# Altium schematic sheet 03B_DDR3_2.SchDoc
size 420 x 297 mm
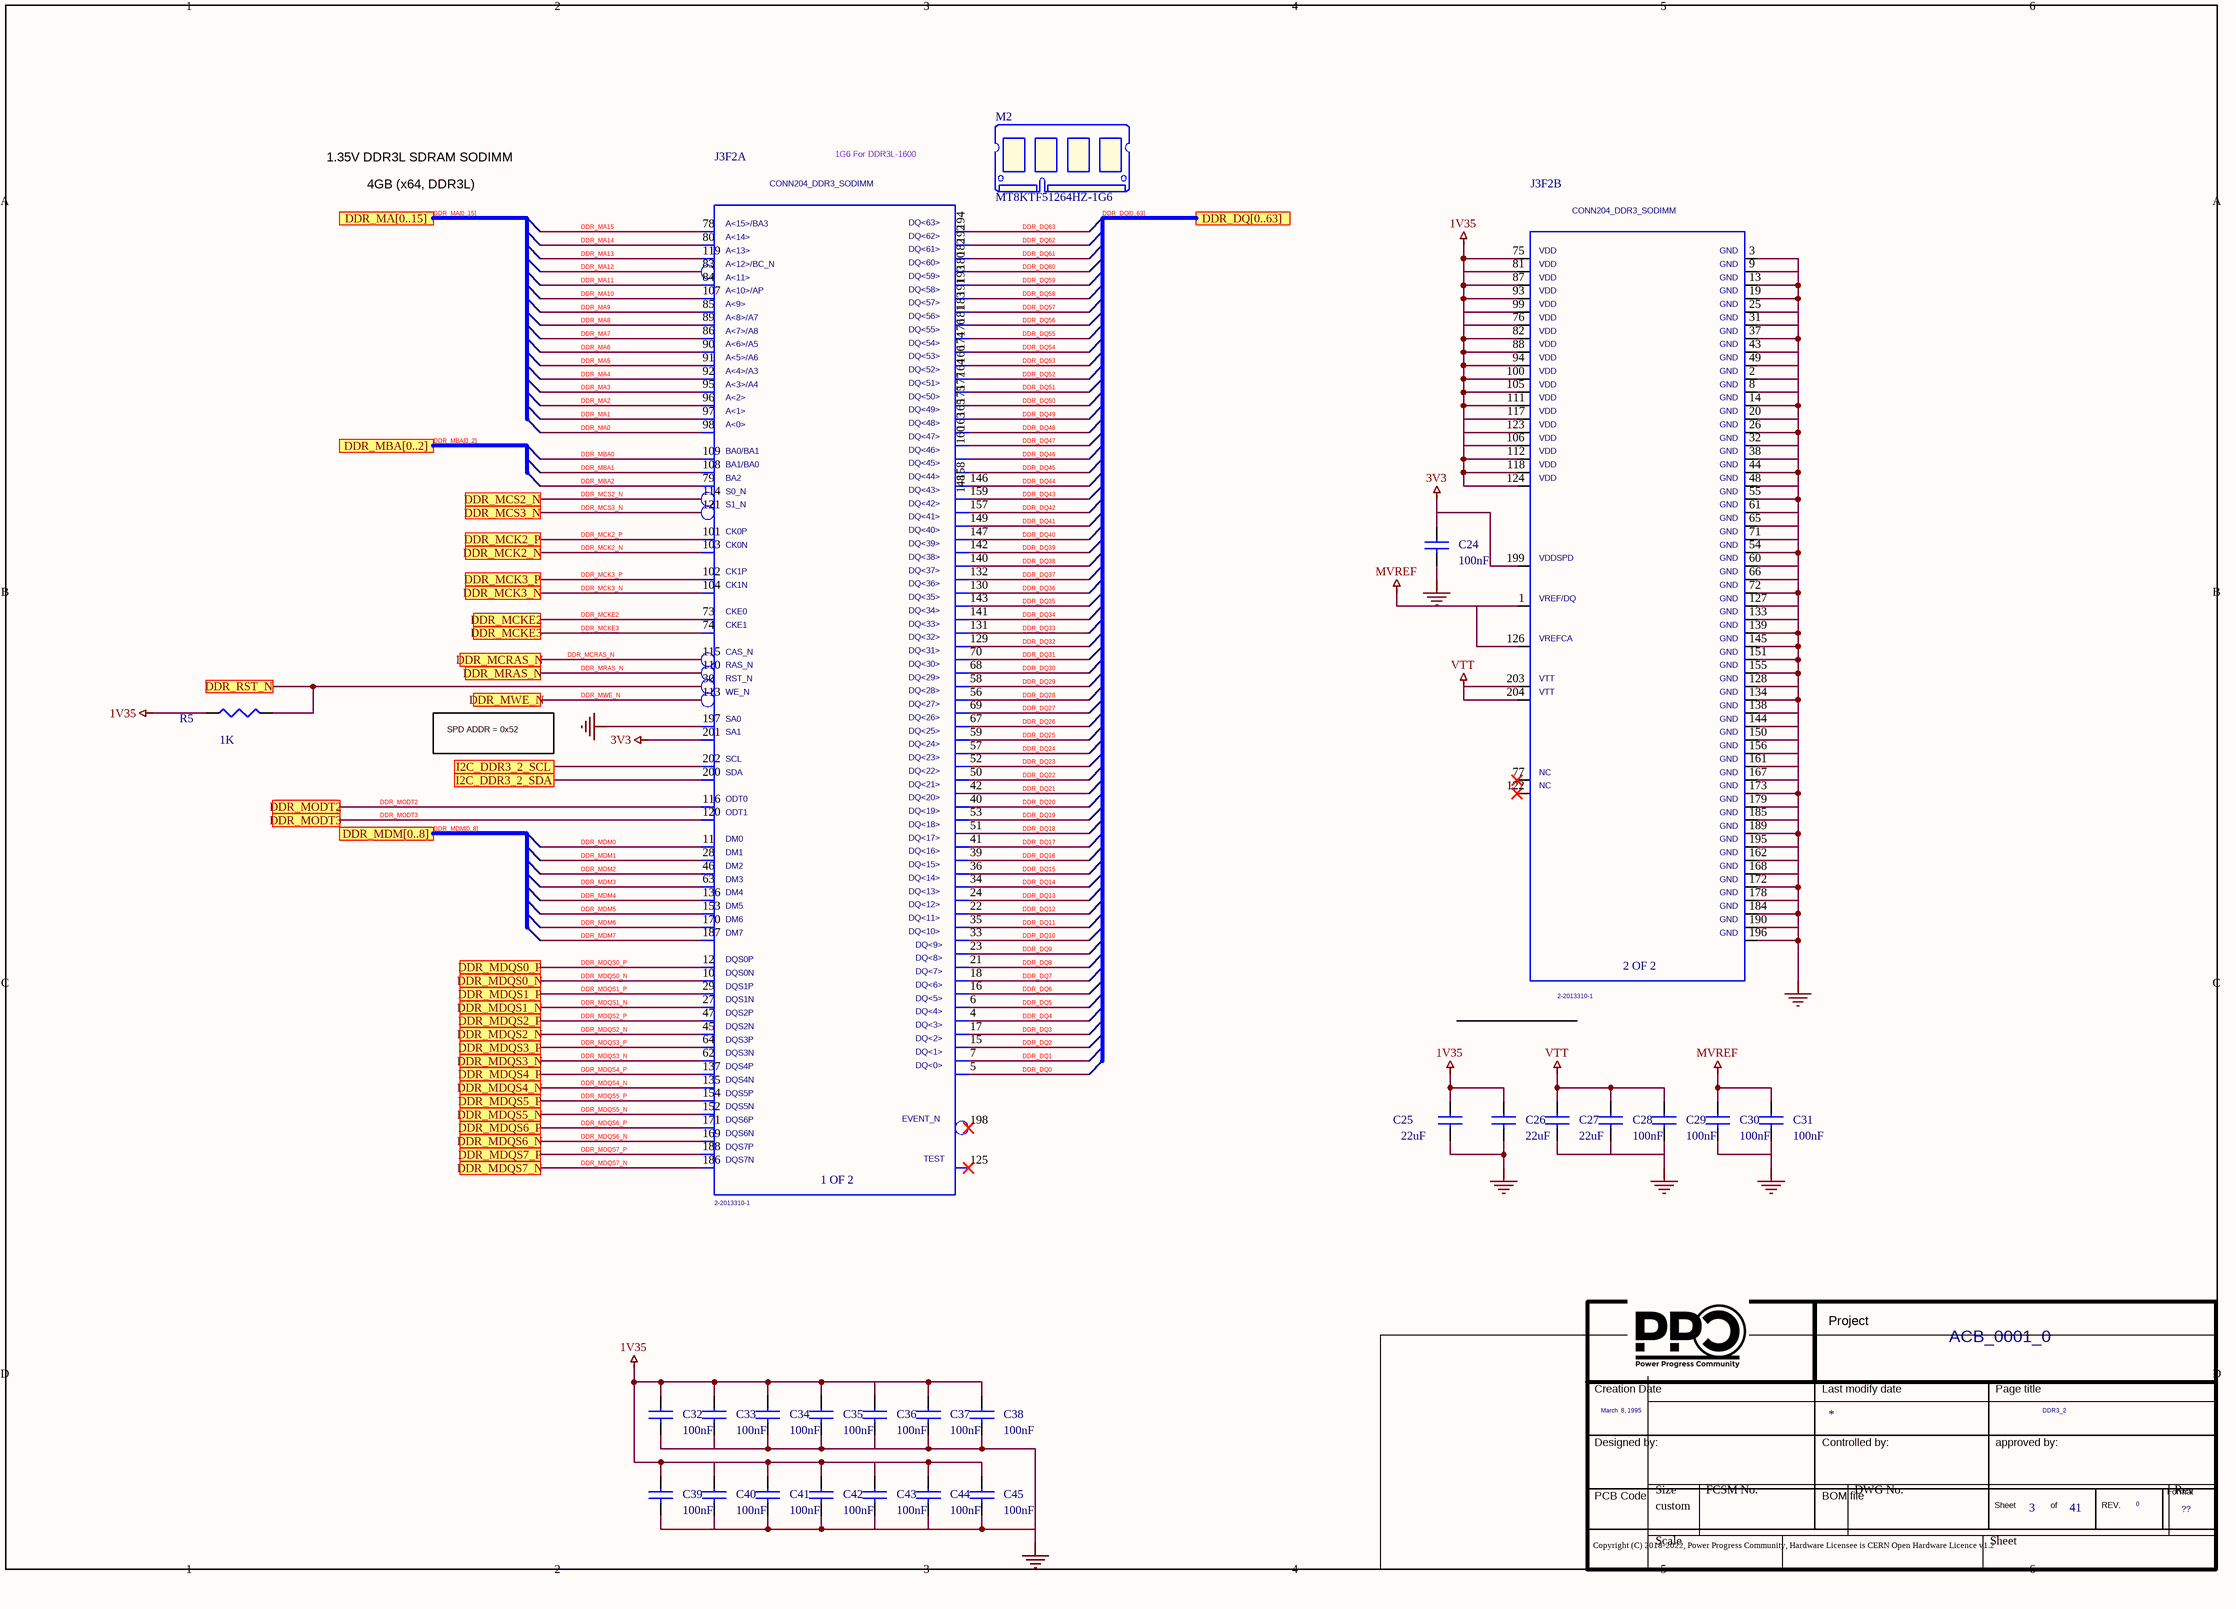
[diagram p0: 03B_DDR3_2.SchDoc]

## Parts
*  Page Count: 41  Page Create Date: March  8, 1995  Page Number: 3  Page Size: ??  Page Title: DDR3_2  RevCode: 0  Title: ACB_0001_0  (hidden comment: Title_block_PPC)  (graphical)
C24  100nF  [SMD_0402]
C25  22uF  [SMD_0805]
C26  22uF  [SMD_0805]
C27  22uF  [SMD_0805]
C28  100nF  [SMD_0402]
C29  100nF  [SMD_0402]
C30  100nF  [SMD_0402]
C31  100nF  [SMD_0402]
C32  100nF  [SMD_0402]
C33  100nF  [SMD_0402]
C34  100nF  [SMD_0402]
C35  100nF  [SMD_0402]
C36  100nF  [SMD_0402]
C37  100nF  [SMD_0402]
C38  100nF  [SMD_0402]
C39  100nF  [SMD_0402]
C40  100nF  [SMD_0402]
C41  100nF  [SMD_0402]
C42  100nF  [SMD_0402]
C43  100nF  [SMD_0402]
C44  100nF  [SMD_0402]
C45  100nF  [SMD_0402]
J3F2  2-2013310-1  PART_SYM_NUM: 1 OF 2  [204 PIN PASSO 0.6mm]  (parts A,B of 2)
M2  MT8KTF51264HZ-1G6  [none]
R5  1K  [SMD_0402]

## Ports
DDR_DQ[0..63], DDR_MA[0..15], DDR_MBA[0..2], DDR_MCK2_N, DDR_MCK2_P, DDR_MCK3_N, DDR_MCK3_P, DDR_MCKE2, DDR_MCKE3, DDR_MCRAS_N, DDR_MCS2_N, DDR_MCS3_N, DDR_MDM[0..8], DDR_MDQS0_N, DDR_MDQS0_P, DDR_MDQS1_N, DDR_MDQS1_P, DDR_MDQS2_N, DDR_MDQS2_P, DDR_MDQS3_N, DDR_MDQS3_P, DDR_MDQS4_N, DDR_MDQS4_P, DDR_MDQS5_N, DDR_MDQS5_P, DDR_MDQS6_N, DDR_MDQS6_P, DDR_MDQS7_N, DDR_MDQS7_P, DDR_MODT2, DDR_MODT3, DDR_MRAS_N, DDR_MWE_N, DDR_RST_N, I2C_DDR3_2_SCL, I2C_DDR3_2_SDA

## Nets
1V35: C25.1 C26.1 C32.1 C33.1 C34.1 C35.1 C36.1 C37.1 C38.1 C39.1 C40.1 C41.1 C42.1 C43.1 C44.1 C45.1 J3F2.75(VDD_75) J3F2.76(VDD_76) J3F2.81(VDD_81) J3F2.82(VDD_82) J3F2.87(VDD_87) J3F2.88(VDD_88) J3F2.93(VDD_93) J3F2.94(VDD_94) J3F2.99(VDD_99) J3F2.100(VDD_100) J3F2.105(VDD_105) J3F2.106(VDD_106) J3F2.111(VDD_111) J3F2.112(VDD_112) J3F2.117(VDD_117) J3F2.118(VDD_118) J3F2.123(VDD_123) J3F2.124(VDD_124) R5.1
3V3: C24.1 J3F2.199(VDDSPD) J3F2.201(SA1)
GND: C24.2 C25.2 C26.2 C27.2 C28.2 C29.2 C30.2 C31.2 C32.2 C33.2 C34.2 C35.2 C36.2 C37.2 C38.2 C39.2 C40.2 C41.2 C42.2 C43.2 C44.2 C45.2 J3F2.2(GND_2) J3F2.3(GND_3) J3F2.8(GND_8) J3F2.9(GND_9) J3F2.13(GND_13) J3F2.14(GND_14) J3F2.19(GND_19) J3F2.20(GND_20) J3F2.25(GND_25) J3F2.26(GND_26) J3F2.31(GND_31) J3F2.32(GND_32) J3F2.37(GND_37) J3F2.38(GND_38) J3F2.43(GND_43) J3F2.44(GND_44) J3F2.48(GND_48) J3F2.49(GND_49) J3F2.54(GND_54) J3F2.55(GND_55) J3F2.60(GND_60) J3F2.61(GND_61) J3F2.65(GND_65) J3F2.66(GND_66) J3F2.71(GND_71) J3F2.72(GND_72) J3F2.127(GND_127) J3F2.128(GND_128) J3F2.133(GND_133) J3F2.134(GND_134) J3F2.138(GND_138) J3F2.139(GND_139) J3F2.144(GND_144) J3F2.145(GND_145) J3F2.150(GND_150) J3F2.151(GND_151) J3F2.155(GND_155) J3F2.156(GND_156) J3F2.161(GND_161) J3F2.162(GND_162) J3F2.167(GND_167) J3F2.168(GND_168) J3F2.172(GND_172) J3F2.173(GND_173) J3F2.178(GND_178) J3F2.179(GND_179) J3F2.184(GND_184) J3F2.185(GND_185) J3F2.189(GND_189) J3F2.190(GND_190) J3F2.195(GND_195) J3F2.196(GND_196) J3F2.197(SA0)
MVREF: C30.1 C31.1 J3F2.1(VREF_DQ) J3F2.126(VREFCA)
VTT: C27.1 C28.1 C29.1 J3F2.203(VTT_203) J3F2.204(VTT_204)
DDR_DQ0: J3F2.5(DQ[0])
DDR_DQ1: J3F2.7(DQ[1])
DDR_DQ2: J3F2.15(DQ[2])
DDR_DQ3: J3F2.17(DQ[3])
DDR_DQ4: J3F2.4(DQ[4])
DDR_DQ5: J3F2.6(DQ[5])
DDR_DQ6: J3F2.16(DQ[6])
DDR_DQ7: J3F2.18(DQ[7])
DDR_DQ8: J3F2.21(DQ[8])
DDR_DQ9: J3F2.23(DQ[9])
DDR_DQ10: J3F2.33(DQ[10])
DDR_DQ11: J3F2.35(DQ[11])
DDR_DQ12: J3F2.22(DQ[12])
DDR_DQ13: J3F2.24(DQ[13])
DDR_DQ14: J3F2.34(DQ[14])
DDR_DQ15: J3F2.36(DQ[15])
DDR_DQ16: J3F2.39(DQ[16])
DDR_DQ17: J3F2.41(DQ[17])
DDR_DQ18: J3F2.51(DQ[18])
DDR_DQ19: J3F2.53(DQ[19])
DDR_DQ20: J3F2.40(DQ[20])
DDR_DQ21: J3F2.42(DQ[21])
DDR_DQ22: J3F2.50(DQ[22])
DDR_DQ23: J3F2.52(DQ[23])
DDR_DQ24: J3F2.57(DQ[24])
DDR_DQ25: J3F2.59(DQ[25])
DDR_DQ26: J3F2.67(DQ[26])
DDR_DQ27: J3F2.69(DQ[27])
DDR_DQ28: J3F2.56(DQ[28])
DDR_DQ29: J3F2.58(DQ[29])
DDR_DQ30: J3F2.68(DQ[30])
DDR_DQ31: J3F2.70(DQ[31])
DDR_DQ32: J3F2.129(DQ[32])
DDR_DQ33: J3F2.131(DQ[33])
DDR_DQ34: J3F2.141(DQ[34])
DDR_DQ35: J3F2.143(DQ[35])
DDR_DQ36: J3F2.130(DQ[36])
DDR_DQ37: J3F2.132(DQ[37])
DDR_DQ38: J3F2.140(DQ[38])
DDR_DQ39: J3F2.142(DQ[39])
DDR_DQ40: J3F2.147(DQ[40])
DDR_DQ41: J3F2.149(DQ[41])
DDR_DQ42: J3F2.157(DQ[42])
DDR_DQ43: J3F2.159(DQ[43])
DDR_DQ44: J3F2.146(DQ[44])
DDR_DQ45: J3F2.148(DQ[45])
DDR_DQ46: J3F2.158(DQ[46])
DDR_DQ47: J3F2.160(DQ[47])
DDR_DQ48: J3F2.163(DQ[48])
DDR_DQ49: J3F2.165(DQ[49])
DDR_DQ50: J3F2.175(DQ[50])
DDR_DQ51: J3F2.177(DQ[51])
DDR_DQ52: J3F2.164(DQ[52])
DDR_DQ53: J3F2.166(DQ[53])
DDR_DQ54: J3F2.174(DQ[54])
DDR_DQ55: J3F2.176(DQ[55])
DDR_DQ56: J3F2.181(DQ[56])
DDR_DQ57: J3F2.183(DQ[57])
DDR_DQ58: J3F2.191(DQ[58])
DDR_DQ59: J3F2.193(DQ[59])
DDR_DQ60: J3F2.180(DQ[60])
DDR_DQ61: J3F2.182(DQ[61])
DDR_DQ62: J3F2.192(DQ[62])
DDR_DQ63: J3F2.194(DQ[63])
DDR_MA0: J3F2.98(A[0])
DDR_MA1: J3F2.97(A[1])
DDR_MA2: J3F2.96(A[2])
DDR_MA3: J3F2.95(A[3])
DDR_MA4: J3F2.92(A[4])
DDR_MA5: J3F2.91(A[5])
DDR_MA6: J3F2.90(A[6])
DDR_MA7: J3F2.86(A[7])
DDR_MA8: J3F2.89(A[8])
DDR_MA9: J3F2.85(A[9])
DDR_MA10: J3F2.107(A[10])
DDR_MA11: J3F2.84(A[11])
DDR_MA12: J3F2.83(A[12])
DDR_MA13: J3F2.119(A[13])
DDR_MA14: J3F2.80(A[14])
DDR_MA15: J3F2.78(A[15])
DDR_MBA0: J3F2.109(BA0_BA1)
DDR_MBA1: J3F2.108(BA1_BA0)
DDR_MBA2: J3F2.79(BA2)
DDR_MCK2_N: J3F2.103(CK0N) ; port DDR_MCK2_N
DDR_MCK2_P: J3F2.101(CK0P) ; port DDR_MCK2_P
DDR_MCK3_N: J3F2.104(CK1N) ; port DDR_MCK3_N
DDR_MCK3_P: J3F2.102(CK1P) ; port DDR_MCK3_P
DDR_MCKE2: J3F2.73(CKE0) ; port DDR_MCKE2
DDR_MCKE3: J3F2.74(CKE1) ; port DDR_MCKE3
DDR_MCRAS_N: J3F2.115(CAS_N) ; port DDR_MCRAS_N
DDR_MCS2_N: J3F2.114(S0_N) ; port DDR_MCS2_N
DDR_MCS3_N: J3F2.121(S1_N) ; port DDR_MCS3_N
DDR_MDM0: J3F2.11(DM0)
DDR_MDM1: J3F2.28(DM1)
DDR_MDM2: J3F2.46(DM2)
DDR_MDM3: J3F2.63(DM3)
DDR_MDM4: J3F2.136(DM4)
DDR_MDM5: J3F2.153(DM5)
DDR_MDM6: J3F2.170(DM6)
DDR_MDM7: J3F2.187(DM7)
DDR_MDQS0_N: J3F2.10(DQS0N) ; port DDR_MDQS0_N
DDR_MDQS0_P: J3F2.12(DQS0P) ; port DDR_MDQS0_P
DDR_MDQS1_N: J3F2.27(DQS1N) ; port DDR_MDQS1_N
DDR_MDQS1_P: J3F2.29(DQS1P) ; port DDR_MDQS1_P
DDR_MDQS2_N: J3F2.45(DQS2N) ; port DDR_MDQS2_N
DDR_MDQS2_P: J3F2.47(DQS2P) ; port DDR_MDQS2_P
DDR_MDQS3_N: J3F2.62(DQS3N) ; port DDR_MDQS3_N
DDR_MDQS3_P: J3F2.64(DQS3P) ; port DDR_MDQS3_P
DDR_MDQS4_N: J3F2.135(DQS4N) ; port DDR_MDQS4_N
DDR_MDQS4_P: J3F2.137(DQS4P) ; port DDR_MDQS4_P
DDR_MDQS5_N: J3F2.152(DQS5N) ; port DDR_MDQS5_N
DDR_MDQS5_P: J3F2.154(DQS5P) ; port DDR_MDQS5_P
DDR_MDQS6_N: J3F2.169(DQS6N) ; port DDR_MDQS6_N
DDR_MDQS6_P: J3F2.171(DQS6P) ; port DDR_MDQS6_P
DDR_MDQS7_N: J3F2.186(DQS7N) ; port DDR_MDQS7_N
DDR_MDQS7_P: J3F2.188(DQS7P) ; port DDR_MDQS7_P
DDR_MODT2: J3F2.116(ODT0) ; port DDR_MODT2
DDR_MODT3: J3F2.120(ODT1) ; port DDR_MODT3
DDR_MRAS_N: J3F2.110(RAS_N) ; port DDR_MRAS_N
DDR_MWE_N: J3F2.113(WE_N) ; port DDR_MWE_N
DDR_RST_N: J3F2.30(RST_N) R5.2 ; port DDR_RST_N
I2C_DDR3_2_SCL: J3F2.202(SCL) ; port I2C_DDR3_2_SCL
I2C_DDR3_2_SDA: J3F2.200(SDA) ; port I2C_DDR3_2_SDA

Not connected (* = marked no-connect by the designer): J3F2 77(NC_77)* 122(NC_122)* 125(TEST)* 198(EVENT_N)*

## Buses and harness runs
bus DDR_DQ[0..63] = port DDR_DQ[0..63]
bus DDR_MA[0..15] = port DDR_MA[0..15]
bus DDR_MBA[0..2] = port DDR_MBA[0..2]
bus DDR_MDM[0..8] = port DDR_MDM[0..8]

## Notes on the sheet
- 1.35V DDR3L SDRAM SODIMM
- 4GB (x64, DDR3L)
- 1G6 For DDR3L-1600
- SPD ADDR = 0x52
- (in symbol CONN204_DDR3_SODIMM, part A) A<15>/BA3; DQ<63>; A<14>; DQ<62>; A<13>; DQ<61>; A<12>/BC_N; DQ<60>; A<11>; DQ<59>; A<10>/AP; DQ<58>; A<9>; DQ<57>; A<8>/A7; DQ<56>; A<7>/A8; DQ<55>; A<6>/A5; DQ<54>; A<5>/A6; DQ<53>; A<4>/A3; DQ<52>; A<3>/A4; DQ<51>; A<2>; DQ<50>; A<1>; DQ<49>; A<0>; DQ<48>; DQ<47>; BA0/BA1; DQ<46>; BA1/BA0; DQ<45>; DQ<44>; DQ<43>; DQ<42>; DQ<41>; DQ<40>; DQ<39>; DQ<38>; DQ<37>; DQ<36>; DQ<35>; DQ<34>; DQ<33>; DQ<32>; DQ<31>; DQ<30>; DQ<29>; DQ<28>; DQ<27>; DQ<26>; DQ<25>; DQ<24>; DQ<23>; DQ<22>; DQ<21>; DQ<20>; DQ<19>; DQ<18>; DQ<17>; DQ<16>; DQ<15>; DQ<14>; DQ<13>; DQ<12>; DQ<11>; DQ<10>; DQ<9>; DQ<8>; DQ<7>; DQ<6>; DQ<5>; DQ<4>; DQ<3>; DQ<2>; DQ<1>; DQ<0>
- (in symbol CONN204_DDR3_SODIMM, part B) VDD; GND; VREF/DQ; VTT; NC
- (in symbol Title_block_PPC) Project; Creation Date; Last modify date; Page title; Designed by:; Controlled by:; approved by:; Format; PCB Code; BOM file; Sheet; of; REV.; Copyright (C) 2018-2022, Power Progress Community, Hardware Licensee is CERN Open Hardware Licence v1.2

## Library data of the parts
C24 C28-C45 = CAP NP_Dup3: COND.CER. 100NF 50V 0402 X7R SMD; Part Number: PASSIVE_24; Manufacturer 1: TDK; Manufacturer Part Number 1: CGA2B3X7R1H104M050BD; RSM: RC0402; Part Type: Capacitors\Ceramic\SMD\0402; PCB Footprint: SMD_0402
C25 = CAP NP_Dup3: 22UF 35V 20% 0805; Part Number: PASSIVE_224; Manufacturer 1: TDK; Manufacturer Part Number 1: C2012X5R1V226M125AC; RSM: RC0805; PCB Footprint: SMD_0805; Part Type: Capacitors\Ceramic\SMD\0805
C26 C27 = CAP NP_Dup3: 22UF 35V 20% 0805; Manufacturer Part Number 1: C2012X5R1V226M125AC; Manufacturer 1: TDK; Part Number: PASSIVE_224; RSM: RC0805; PCB Footprint: SMD_0805; Part Type: Capacitors\Ceramic\SMD\0805
J3F2 = CONN204_DDR3_SODIMM: DIMM EMBOSS TAPE DDR3 204P 9.2H STD; PART_NUMBER: E85705-003; Manufacturer 1: TE; Part Number: CONNECTORS_696; CDS_PART_NAME: CONN204_DDR3_SODIMM_SMLF-E85705-003; OriginalSymbolOrigin: (-500,1850); PACK_TYPE: SMLF; RSM: TE-2-2013310-1; CDS_LIB: lf_for_review_only; DRAWING: @OXBOW_HILL_LIB.OXBOW_HILL(SCH_1):PAGE284; LOCATION: J3F1; PHYS_PAGE: 28; ROT: 0; VER: 1; XY: (900,1475); CaptureCellPackProp: CONN204_DDR3_SODIMMA; MATERIAL: CONN; PCB Footprint: 204 PIN PASSO 0.6mm; Distributor 1: MOUSER(571-2-2013310-1); Manufacturer Part Number 1: 2-2013310-1; Part Type: DIMM; CDS_PHYS_PART_NAME: CONN204_DDR3_SODIMM_SMLF-E85705-003; CHIPS_PART_NAME: CONN204_DDR3_SODIMM; SEC_TYPE: SMLF
M2 = DDR_MDL: MPN: MT18KSF51272HZ-1G6; Vendor: Micron; PCB Footprint: none; TYPE: MEC
R5 = R_Dup6: RESIS.CHIP 1K 1% 0402 SMD; Manufacturer 1: ROYAL OHM; Part Number: PASSIVE_628; RSM: RC0402; Manufacturer Part Number 1: RESIS.CHIP 1K 1% 0402 SMD; Part Type: Resistors\Fixed\SMD\0402\1%; PCB Footprint: SMD_0402
* = Title_block_PPC: Page Modify Date: *